# Altium project au_analoge_conversion.PrjPcb
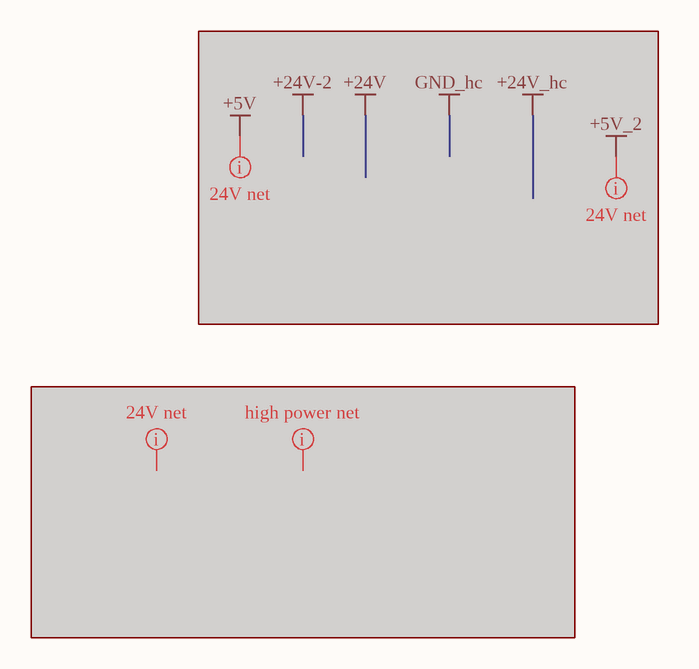
[diagram p0: Classes.SchDoc]
4 sheets, 134 parts. Net scope: hierarchical (ports join the sheet entries above them; power ports are global).
Board file: board.PcbDoc
Sheets:
  Classes.SchDoc
  sheet_top.SchDoc
    sheetPower = Sheet_Power.SchDoc
    A = Sheet1.SchDoc
    B = Sheet1.SchDoc
    C = Sheet1.SchDoc
    D = Sheet1.SchDoc
    E = Sheet1.SchDoc
    F = Sheet1.SchDoc
    G = Sheet1.SchDoc
    H = Sheet1.SchDoc

## Sheet Classes.SchDoc
size A4

### Layout directives
net class 24V_net: (no net found under the mark)
net class high_power_net: (no net found under the mark)

## Sheet sheet_top.SchDoc
size A4
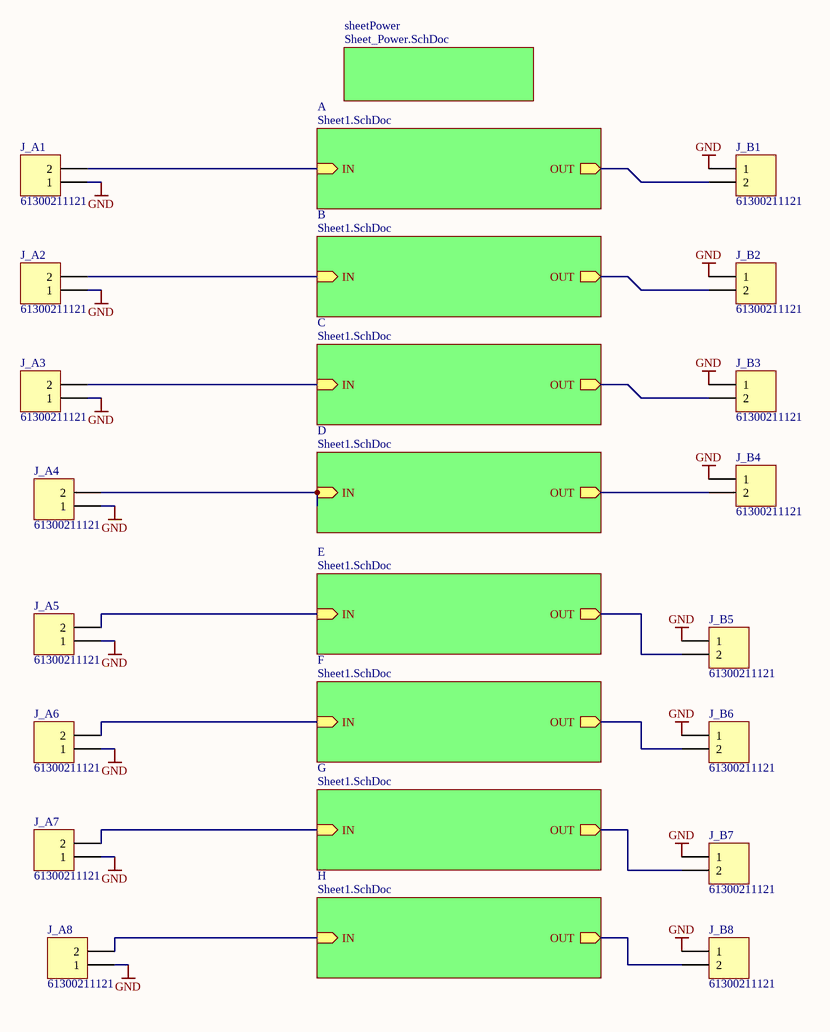
[diagram p1: sheet_top.SchDoc]

### Parts
J_A1  61300211121  [61300211121]
J_A2  61300211121  [61300211121]
J_A3  61300211121  [61300211121]
J_A4  61300211121  [61300211121]
J_A5  61300211121  [61300211121]
J_A6  61300211121  [61300211121]
J_A7  61300211121  [61300211121]
J_A8  61300211121  [61300211121]
J_B1  61300211121  [61300211121]
J_B2  61300211121  [61300211121]
J_B3  61300211121  [61300211121]
J_B4  61300211121  [61300211121]
J_B5  61300211121  [61300211121]
J_B6  61300211121  [61300211121]
J_B7  61300211121  [61300211121]
J_B8  61300211121  [61300211121]

### Sub-sheets
A = Sheet1.SchDoc: OUT (out), IN (in)
B = Sheet1.SchDoc: OUT (out), IN (in)
C = Sheet1.SchDoc: OUT (out), IN (in)
D = Sheet1.SchDoc: OUT (out), IN (in)
E = Sheet1.SchDoc: OUT (out), IN (in)
F = Sheet1.SchDoc: OUT (out), IN (in)
G = Sheet1.SchDoc: OUT (out), IN (in)
H = Sheet1.SchDoc: OUT (out), IN (in)
sheetPower = Sheet_Power.SchDoc: no entries

### Nets
GND: J_A1.1 J_A2.1 J_A3.1 J_A4.1 J_A5.1 J_A6.1 J_A7.1 J_A8.1 J_B1.1 J_B2.1 J_B3.1 J_B4.1 J_B5.1 J_B6.1 J_B7.1 J_B8.1
NetJ1_A_1: J_A1.2 ; sheet A/IN
NetJ1_B_1: J_A2.2 ; sheet B/IN
NetJ1_C_1: J_A3.2 ; sheet C/IN
NetJ1_D_1: J_A4.2 ; sheet D/IN
NetJ1_E_1: J_A5.2 ; sheet E/IN
NetJ1_F_1: J_A6.2 ; sheet F/IN
NetJ1_G_1: J_A7.2 ; sheet G/IN
NetJ1_H_1: J_A8.2 ; sheet H/IN
NetJ3_A_2: J_B1.2 ; sheet A/OUT
NetJ3_B_2: J_B2.2 ; sheet B/OUT
NetJ3_C_2: J_B3.2 ; sheet C/OUT
NetJ3_D_2: J_B4.2 ; sheet D/OUT
NetJ3_E_2: J_B5.2 ; sheet E/OUT
NetJ3_F_2: J_B6.2 ; sheet F/OUT
NetJ3_G_2: J_B7.2 ; sheet G/OUT
NetJ3_H_2: J_B8.2 ; sheet H/OUT

### Notes on the sheet
- Title
- Size:
- Modified:
- A4
- Project:
- Time:
- Sheet
- of
- Created:
- Author:
- Prj. #:
- Alfons Riedinger
- File:
- Revision:

### Library data of the parts
J_A1-J_A8 J_B1-J_B8 = CMP-001-0071-1: 2Pol; gerade; WR-PHD 2.54 mm THT Pin Header; Brand: Wurth Electronics; Current Rating: 3 A; Insulation Resistance: 1 GOhms; Latching Type: Unlatched; Mating Post Length: 6 mm; Mounting Angle: Straight; Number of Positions: 2 Position; Pitch: 2.54 mm; Voltage Rating: 250 V; Accessory Type: -; Application: Wire to Board; ComponentLink1Description: 6130xx11121-538006.pdf; ComponentLink1URL: http://www.mouser.com/ds/2/445/6130xx11121-538006.pdf; Contact Gender: Pin (Male); Contact Material: Copper Alloy; Contact Plating: Gold; Contact Type: -; Flammability Rating: UL 94 V-0; Housing Gender: -; Housing Material: Polybutylene Terephthalate (PBT); Manufacturer: Wurth Electronics; Manufacturer Part Number: 61300211121; Minimum Order Quantity: 1; Mounting Style: Straight Pin; Number of Rows: 1 Row; Packaging: Bulk; Product: Headers; Reeling: False; RoHS - Mouser: Y; Row Spacing: -; Series: WR-PHD; Standard Pack Qty: 1000; Supplier: Mouser; Supplier Part Number: 710-61300211121; Termination Post Length: 3 mm; Termination Style: Through Hole; Type: Pin Strip; PartNumber: 61300211121

## Sheet Sheet_Power.SchDoc
size A4
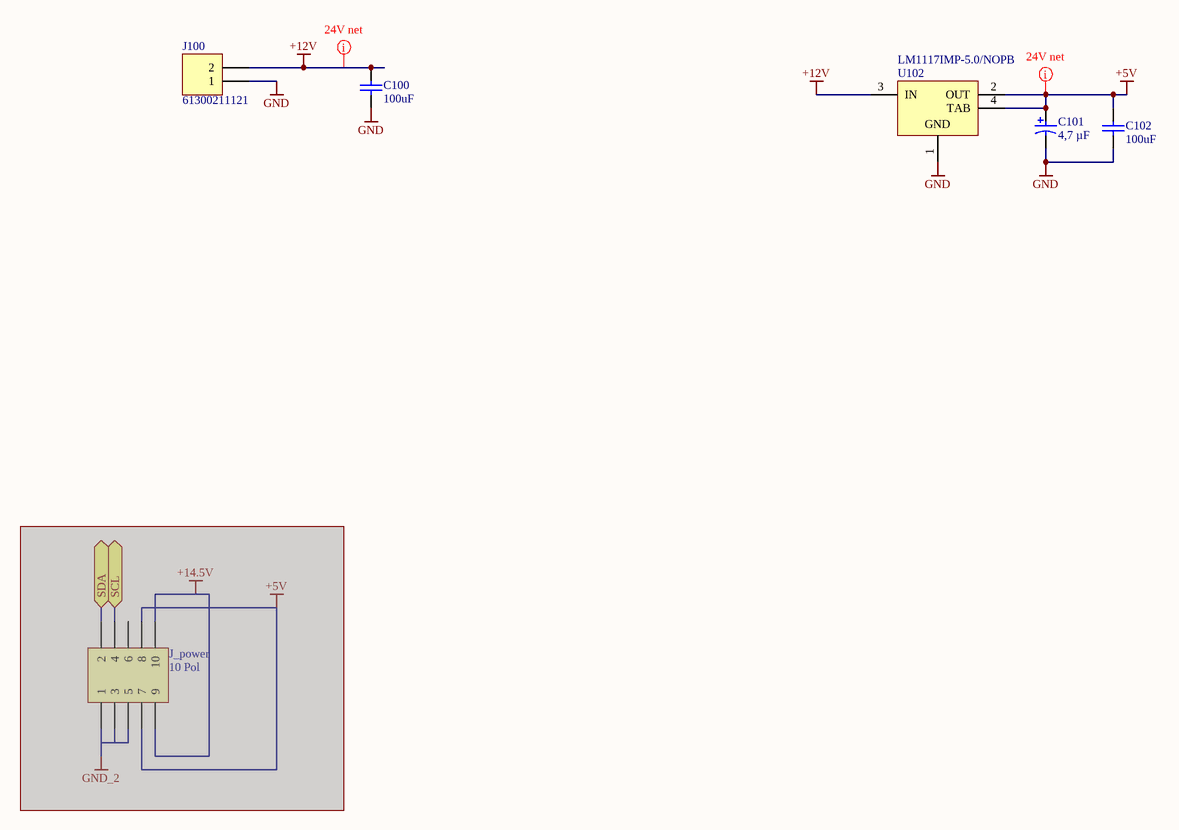
[diagram p2: Sheet_Power.SchDoc]

### Parts
C100  100uF  [CAPC1206(3216)190_L]
C101  4,7 µF  [A Package]
C102  100uF  [CAPC1206(3216)190_L]
J100  61300211121  [61300211121]
J_power  10 Pol  [WR-BHD_612 010 221 21]  (masked out: inside a compile mask, not in the netlist)
U102  LM1117IMP-5.0/NOPB  [DCY0004A_M]

### Ports
SCL (bidir), SDA (bidir)

### Nets
+5V: C101.1 C102.2 U102.2(OUT) U102.4(TAB)
+12V: C100.2 J100.2 U102.3(IN)
GND: C100.1 C101.2 C102.1 J100.1 U102.1(GND)

### Layout directives
net class 24V_net: +5V, +12V

### Library data of the parts
C100 C102 = CMP-00469-2: CAP 100uF 6.3V ±20% 1206 (3216 Metric) Thickness 1.9mm SMD; PartNumber: 885012108005; Manufacturer: WURTH ELEKTRONIK; Tolerance: Â±20%; Case-EIA: 1206; Case-Metric: 3216; Technology: SMT; Max Thickness: 1.9 mm; Rated Voltage: 6.3 V; Value: 100uF; Supplier: Farnell; Supplier Part Number: 2495155; ComponentLink1Description: 2326302.pdf; ComponentLink1URL: http://www.farnell.com/cad/2326302.pdf; ComponentLink2Description: 1958456.pdf; ComponentLink2URL: http://www.farnell.com/datasheets/1958456.pdf; Manufacturer Part Number: 885012108005
C101 = CMP-001-0039-3: 4,7 µF; 6V; Gr. A; T491A475K006AT; Manufacturer: KEMET; Capacitance: 4.7µF; ESR (Equivalent Series Resistance): 6 Ohm; Lifetime @ Temp.: 2000 Hrs @ 85°C; Tolerance: ±10%; Type: Molded; Voltage - Rated: 6.3V; ComponentLink1Description: KEM_T2005_T491.pdf; ComponentLink1URL: http://www.kemet.com/Lists/ProductCatalog/Attachments/254/KEM_T2005_T491.pdf; Failure Rate: -; Features: General Purpose; Height - Seated (Max): 0.071" (1.80mm); Lead Spacing: -; Manufacturer Size Code: A; Mounting Type: Surface Mount; Operating Temperature: -55°C ~ 125°C; Package / Case: 1206 (3216 Metric); Packaging: Cut Tape (CT); Part Status: Active; Size / Dimension: 0.126" L x 0.063" W (3.20mm x 1.60mm); Supplier: Digi-Key; Supplier Part Number: 399-9717-1-ND; PartNumber: T491A475K006AT
J100 = CMP-001-0071-1: as J_A1 on sheet sheet_top; Accessory Type: -; Application: Wire to Board; ComponentLink1Description: 6130xx11121-538006.pdf; ComponentLink1URL: http://www.mouser.com/ds/2/445/6130xx11121-538006.pdf; Contact Gender: Pin (Male); Contact Material: Copper Alloy; Contact Plating: Gold; Contact Type: -; Flammability Rating: UL 94 V-0; Housing Gender: -; Housing Material: Polybutylene Terephthalate (PBT); Manufacturer: Wurth Electronics; Manufacturer Part Number: 61300211121; Minimum Order Quantity: 1; Mounting Style: Straight Pin; Number of Rows: 1 Row; Packaging: Bulk; Product: Headers; Reeling: False; RoHS - Mouser: Y; Row Spacing: -; Series: WR-PHD; Standard Pack Qty: 1000; Supplier: Mouser; Supplier Part Number: 710-61300211121; Termination Post Length: 3 mm; Termination Style: Through Hole; Type: Pin Strip; PartNumber: 61300211121
J_power = 10 Pol _ 2,54mm_ 612 010 2xx 21: Manufacturer: W¨¹rth Elektronik eiSos GmbH; partNo: 61201021621; ComponentLink1 Description: Manufacturer; ComponentLink2 Description: Datasheet; NoPins: 10; Created Date: 6 May 2013; ComponentLink1URL: http://www.we-online.com; ComponentLink2URL: http://katalog.we-online.de/em/datasheet/6120xx21621.pdf; Created by: Karrer Zheng
U102 = CMP-00485-1: 800mA Low-Dropout Linear Regulator, 4-pin SOT-223, Pb-Free; Manufacturer: Texas Instruments; PackageTopMarking: XYTT*N06B; CompType: LDO IC; PowerWise: N; High-Reliability: Y; RoHS: Y; Code_JEDEC: TO-261-AA; ComponentLink1URL: http://www.ti.com/general/docs/lit/getliterature.tsp?genericPartNumber=LM1117-N&fileType=pdf; Code_IPC: SOT223-4; ComponentLink1Description: Datasheet URL; PartNumber: LM1117IMP-5.0/NOPB; PackageReference: DCY0004A; PinCount: 4; PackageDescription: Molded SOT-223, 6.50 x 3.56 x 1.6mm Body, 4 Lead, 2.3mm Pitch

## Sheet Sheet1.SchDoc
size A4; Author: Christian Kieser; Engineer: Christian Kieser
Used 8 times, as channels A, B, C, D, E, F, G, H. Parts and nets are listed once, with the designators drawn on the sheet.
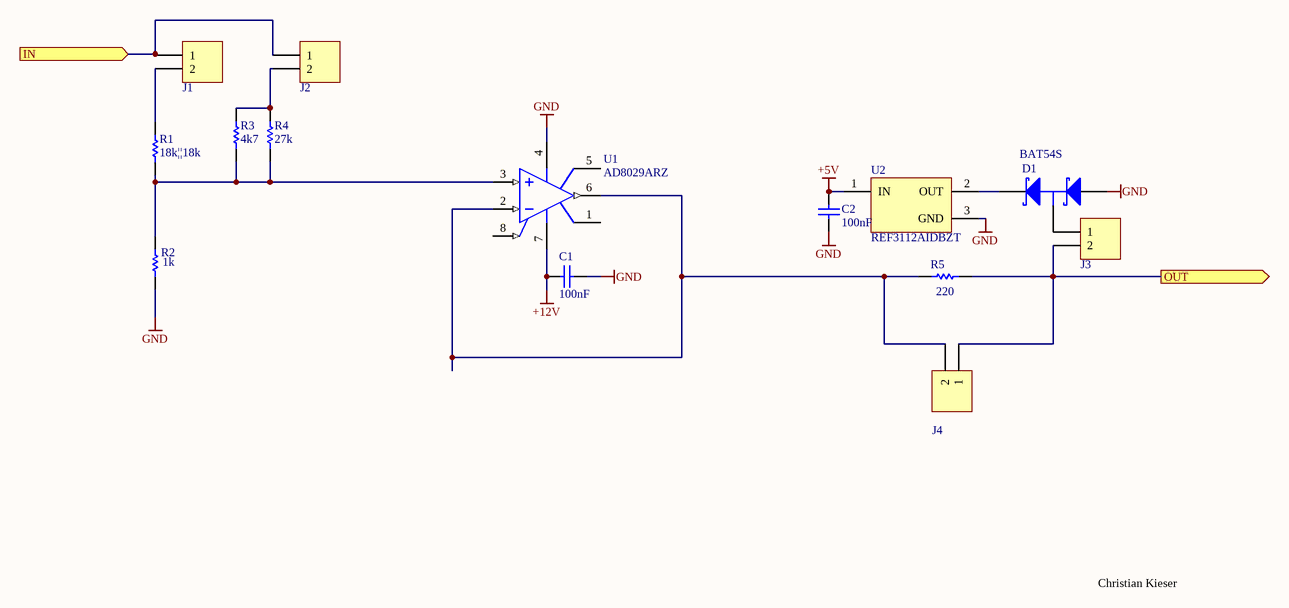
[diagram p3: Sheet1.SchDoc]

### Parts
C1  100nF  [CAPC2013X88X50ML20T25]
C2  100nF  [CAPC2013X88X50ML20T25]
D1  BAT54S  [FAIR-SOT23-3_V]
J1  61300211121  [61300211121]  (value not drawn)
J2  61300211121  [61300211121]  (value not drawn)
J3  61300211121  [61300211121]  (value not drawn)
J4  61300211121  [61300211121]  (value not drawn)
R1  18k||18k  [YAGO-RC0805_M]
R2  1k  [YAGO-RC0805_M]
R3  4k7  [YAGO-RC0805_M]
R4  27k  [YAGO-RC0805_M]
R5  220  [YAGO-RC0805_M]
U1  AD8029ARZ  [ADI-R-8_L]
U2  REF3112AIDBZT  [DBZ0003A_N]

### Ports
IN (in), OUT (out)

### Nets
+5V: C2.1 U2.1(IN)
+12V: C1.2 U1.7(+VS)
GND: C1.1 C2.2 D1.1(A) R2.1 U1.4(-VS) U2.3(GND)
IN: J1.1 J2.1 ; port IN
OUT: J3.2 J4.1 R5.1 ; port OUT
NetD1_2: D1.2(K) U2.2(OUT)
NetD1_3: D1.3(C) J3.1
NetJ1_2: J1.2 R1.2
NetJ2_2: J2.2 R3.2 R4.2
NetJ4_2: J4.2 R5.2 U1.2(-IN) U1.6(VOUT)
NetR1_1: R1.1 R2.2 R3.1 R4.1 U1.3(+IN)

Not connected (* = marked no-connect by the designer): U1 1(NC) 5(NC) 8(~{DISABLE})

### Channels
A: designators end in _A; ports IN=NetJ1_A_1 OUT=NetJ3_A_2
B: designators end in _B; ports IN=NetJ1_B_1 OUT=NetJ3_B_2
C: designators end in _C; ports IN=NetJ1_C_1 OUT=NetJ3_C_2
D: designators end in _D; ports IN=NetJ1_D_1 OUT=NetJ3_D_2
E: designators end in _E; ports IN=NetJ1_E_1 OUT=NetJ3_E_2
F: designators end in _F; ports IN=NetJ1_F_1 OUT=NetJ3_F_2
G: designators end in _G; ports IN=NetJ1_G_1 OUT=NetJ3_G_2
H: designators end in _H; ports IN=NetJ1_H_1 OUT=NetJ3_H_2

### Notes on the sheet
- Christian Kieser
- Title
- Size:
- Modified:
- A4
- Project:
- Time:
- Sheet
- of
- Created:
- Author:
- Prj. #:
- Alfons Riedinger
- File:
- Revision:

### Library data of the parts
C1 C2 = CMP-001-0082-2: generic 0805 COG oder X7R Vielschichtkondensatoren max. +/-10%
D1 = CMP-00532-2: Schottky Barrier Diode, 30 V, 0.2 A, -55 to 150 degC, 3-Pin SOT23, RoHS, Tape and Reel; ESR: 40 Ohm; Frequency: 16 MHz; Load Capacitance: 18 pF; Tolerance: 30ppm; Capacitance: 1.8E-11 f; Pins: 4; Length: 5 mm; ComponentLink3URL: http://www.fairchildsemi.com/dwg/MA/MA03D.pdf; RoHSCompliant: True; REACH SVHC: No SVHC; ComponentLink1URL: https://www.fairchildsemi.com/; Width: 3.2 mm; PackageDescription: 3-Pin Small Outline Transistor, Body 2.92 x 1.325 mm, Pitch 0.95 mm; ComponentLink2Description: Datasheet; Resistance: 40 Ohm; Max Operating Temperature: 70degC; ComponentLink2URL: https://www.fairchildsemi.com/datasheets/BA/BAT54S.pdf; Min Operating Temperature: -10degC; DatasheetVersion: Rev. 2.3, 04/2016; PackageReference: SOT23-3; Height: 0.9 mm; Frequency Tolerance: 30ppm; ComponentLink1Description: Manufacturer URL; Packaging: Tape and Reel; Mount: Surface Mount; Package Quantity: 1000; ComponentLink3Description: Package Specification; PartNumber: BAT54S
J1-J4 = CMP-001-0071-1: as J_A1 on sheet sheet_top; Accessory Type: -; Application: Wire to Board; ComponentLink1Description: 6130xx11121-538006.pdf; ComponentLink1URL: http://www.mouser.com/ds/2/445/6130xx11121-538006.pdf; Contact Gender: Pin (Male); Contact Material: Copper Alloy; Contact Plating: Gold; Contact Type: -; Flammability Rating: UL 94 V-0; Housing Gender: -; Housing Material: Polybutylene Terephthalate (PBT); Manufacturer: Wurth Electronics; Manufacturer Part Number: 61300211121; Minimum Order Quantity: 1; Mounting Style: Straight Pin; Number of Rows: 1 Row; Packaging: Bulk; Product: Headers; Reeling: False; RoHS - Mouser: Y; Row Spacing: -; Series: WR-PHD; Standard Pack Qty: 1000; Supplier: Mouser; Supplier Part Number: 710-61300211121; Termination Post Length: 3 mm; Termination Style: Through Hole; Type: Pin Strip; PartNumber: 61300211121
R1-R5 = CMP-001-0027-2: 0805 Yageo Standard BlackBox Resistors; Power (Watts): 0.125W, 1/8W; Temperature Coefficient: ±200ppm/°C; Tolerance: ±1%; ComponentLink1Description: PYu-RC_Group_51_RoHS_L_7.pdf; Part Status: Active; Size / Dimension: 0.079" L x 0.049" W (2.00mm x 1.25mm); Supplier Device Package: 0805; ComponentLink1URL: http://www.yageo.com/documents/recent/PYu-RC_Group_51_RoHS_L_7.pdf; Composition: Thick Film; Failure Rate: -; Features: Moisture Resistant; Height - Seated (Max): 0.024" (0.60mm); Manufacturer: Yageo; Operating Temperature: -55°C ~ 155°C; Package / Case: 0805 (2012 Metric); Packaging: Digi-Reel®
U1 = CMP-00480-1: Single Channel RRIO Operational Amplifier, 125 MHz BW, 62 V/us SR, Industrial, 8-pin SOIC (R-8), Tube; Manufacturer: Analog Devices; Generic Part Number: AD8029; Slew Rate: 62V/us; V Span Min: 2.7V; Input Bias Current: 700nA; Amplifiers Per Package: 1; Iq/Amp: 1.5mA; V Span Max: 12V; Input Offset Voltage: 1.6mV; Small Signal Bandwidth: 125MHz; PackageVersion: 060506-A; ComponentLink3URL: http://www.analog.com/static/imported-files/packages/PKG_PDF/SOIC_Narrow%20(R)/R_8.pdf; ComponentLink1Description: Manufacturer URL; ComponentLink1URL: http://www.analog.com/en/index.html; Code_JEDEC: MS-012-AA; ComponentLink2URL: http://www.analog.com/static/imported-files/data_sheets/AD8029_8030_8040.pdf; ComponentLink3Description: Package Specification; PackageDescription: 8-Pin Standard Small Outline Package, Body 3.9 x 4.9 mm, Pitch 1.27 mm; PartNumber: AD8029ARZ; Mounting Technology: Surface Mount; PackageReference: R-8; DatasheetVersion: Rev. B; ComponentLink2Description: Datasheet
U2 = CMP-001-0163-A.1: TEXAS INSTRUMENTS - REF3112AIDBZT - VOLTAGE REF, SERIES, 1.25V, SOT-23-3; Max Input Voltage: 5.5V; Max Output Current: 10mA; Max Supply Current: 100uA; Min Input Voltage: 1.8V; Number of Channels: 1; Operating Supply Current: 135uA; Output Type: Fixed; Reference Type: Series,Fixed; Temperature Coefficient: 20ppm/°C; Tolerance: 0.2%; Case/Package: SOT-23; ComponentLink1Description: getliterature.tsp?genericPartNumber=REF3112&fileType=pdf&src-supplier=Farnell; ComponentLink1URL: http://www.ti.com/general/docs/lit/getliterature.tsp?genericPartNumber=REF3112&fileType=pdf&src-supplier=Farnell; ComponentLink2Description: getliterature.tsp?genericPartNumber=REF3112&&fileType=pdf&src-supplier=Element14; ComponentLink2URL: http://www.ti.com/general/docs/lit/getliterature.tsp?genericPartNumber=REF3112&&fileType=pdf&src-supplier=Element14; ComponentLink3Description: getliterature.tsp?genericPartNumber=REF3125&&fileType=pdf&src-supplier=Avnet; ComponentLink3URL: http://www.ti.com/general/docs/lit/getliterature.tsp?genericPartNumber=REF3125&&fileType=pdf&src-supplier=Avnet; ComponentLink4Description: 1814207.pdf?src-supplier=Element14; ComponentLink4URL: http://www.farnell.com/datasheets/1814207.pdf?src-supplier=Element14; ComponentLink5Description: ref3112.pdf?src-supplier=Digi-Key; ComponentLink5URL: http://www.ti.com/lit/ds/symlink/ref3112.pdf?src-supplier=Digi-Key; ComponentLink6Description: 001014454-da-01-en-IC_VREF_SERIES_P_REF3112AIDBZT_SOT_3_TID.pdf?src-supplier=Conrad; ComponentLink6URL: http://www.produktinfo.conrad.com/datenblaetter/1000000-1099999/001014454-da-01-en-IC_VREF_SERIES_P_REF3112AIDBZT_SOT_3_TID.pdf?src-supplier=Conrad; Height: 1mm; Lead Free: Lead Free; Length: 2.92mm; Manufacturer: Texas Instruments; Max Operating Temperature: 125°C; Max Output Voltage: 1.25V; Min Operating Temperature: -40°C; Min Output Voltage: 1.25V; Min Supply Voltage: 1.8V; Nominal Supply Current: 100uA; Number of Pins: 3; Output Current: 10mA; Output Voltage: 1.25V; Package Quantity: 1; Packaging: Tape and Reel; Quiescent Current: 100uA; Radiation Hardening: No; REACH SVHC: No SVHC; Reference Voltage: 1.25V; Supplier: Farnell; Supplier Part Number: 3009310; Termination: SMD/SMT; Width: 1.3mm

## Nets that join several sheets
+5V: Sheet_Power (C101.1 C102.2 U102.2 U102.4), A (C2_A.1 U2_A.1), B (C2_B.1 U2_B.1), C (C2_C.1 U2_C.1), D (C2_D.1 U2_D.1), E (C2_E.1 U2_E.1), F (C2_F.1 U2_F.1), G (C2_G.1 U2_G.1), H (C2_H.1 U2_H.1)
+12V: Sheet_Power (C100.2 J100.2 U102.3), A (C1_A.2 U1_A.7), B (C1_B.2 U1_B.7), C (C1_C.2 U1_C.7), D (C1_D.2 U1_D.7), E (C1_E.2 U1_E.7), F (C1_F.2 U1_F.7), G (C1_G.2 U1_G.7), H (C1_H.2 U1_H.7)
GND: sheet_top (16 pins), Sheet_Power (5 pins), A (6 pins), B (6 pins), C (6 pins), D (6 pins), E (6 pins), F (6 pins), G (6 pins), H (6 pins)
NetJ1_A_1: sheet_top (J_A1.2), A (J1_A.1 J2_A.1)
NetJ1_B_1: sheet_top (J_A2.2), B (J1_B.1 J2_B.1)
NetJ1_C_1: sheet_top (J_A3.2), C (J1_C.1 J2_C.1)
NetJ1_D_1: sheet_top (J_A4.2), D (J1_D.1 J2_D.1)
NetJ1_E_1: sheet_top (J_A5.2), E (J1_E.1 J2_E.1)
NetJ1_F_1: sheet_top (J_A6.2), F (J1_F.1 J2_F.1)
NetJ1_G_1: sheet_top (J_A7.2), G (J1_G.1 J2_G.1)
NetJ1_H_1: sheet_top (J_A8.2), H (J1_H.1 J2_H.1)
NetJ3_A_2: sheet_top (J_B1.2), A (J3_A.2 J4_A.1 R5_A.1)
NetJ3_B_2: sheet_top (J_B2.2), B (J3_B.2 J4_B.1 R5_B.1)
NetJ3_C_2: sheet_top (J_B3.2), C (J3_C.2 J4_C.1 R5_C.1)
NetJ3_D_2: sheet_top (J_B4.2), D (J3_D.2 J4_D.1 R5_D.1)
NetJ3_E_2: sheet_top (J_B5.2), E (J3_E.2 J4_E.1 R5_E.1)
NetJ3_F_2: sheet_top (J_B6.2), F (J3_F.2 J4_F.1 R5_F.1)
NetJ3_G_2: sheet_top (J_B7.2), G (J3_G.2 J4_G.1 R5_G.1)
NetJ3_H_2: sheet_top (J_B8.2), H (J3_H.2 J4_H.1 R5_H.1)